# Altium schematic sheet BluetoothHC05.SchDoc
size A
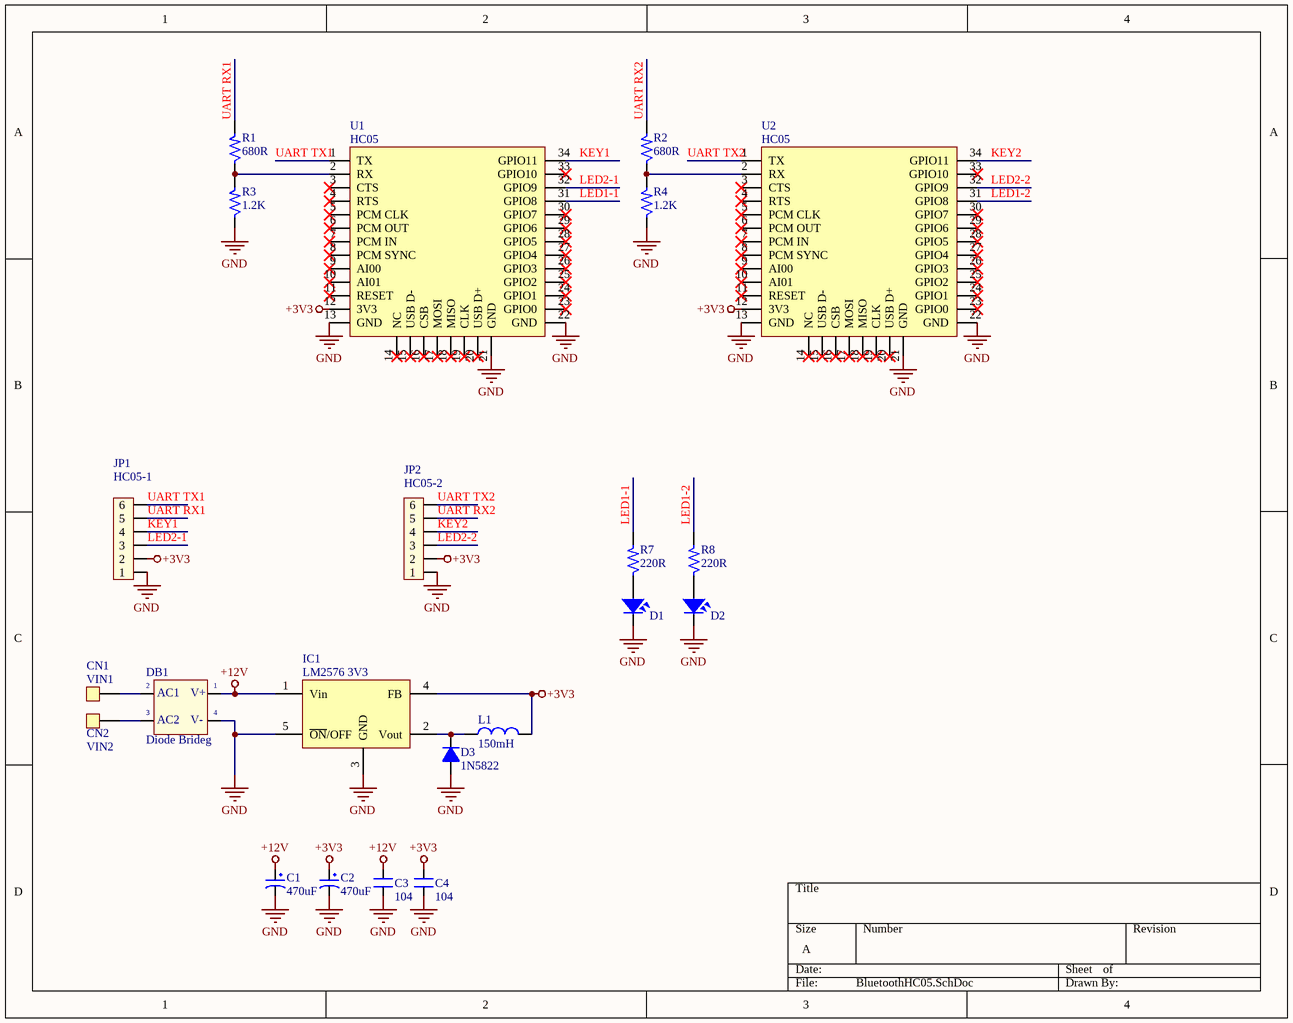
[diagram p0: BluetoothHC05.SchDoc]

## Parts
C1  470uF  [C-TANT-7343-31-CASEA]
C2  470uF  [C-TANT-7343-31-CASEA]
C3  104  [C-0805]
C4  104  [C-0805]
CN1  VIN1  [M3]
CN2  VIN2  [M3]
D1  LED  [LED-0805]  (value not drawn)
D2  LED  [LED-0805]  (value not drawn)
D3  1N5822  [D-DO214-AB]
DB1  Diode Brideg  [D-DB-1A-SMD]
IC1  LM2576 3V3  [TO-263-5L]
JP1  HC05-1  [JP6]
JP2  HC05-2  [JP6]
L1  150mH  [L-SMD-10x10]
R1  680R  [R-0805]
R2  680R  [R-0805]
R3  1.2K  [R-0805]
R4  1.2K  [R-0805]
R7  220R  [R-0805]
R8  220R  [R-0805]
U1  HC05  [LV-BC-2.0]
U2  HC05  [LV-BC-2.0]

## Nets
+3V3: C2.1 C4.2 IC1.4(FB) JP1.2 JP2.2 L1.2 U1.12(3V3) U2.12(3V3)
+12V: C1.1 C3.2 DB1.3(AC2) IC1.1(Vin)
GND: C1.2 C2.2 C3.1 C4.1 D1.2 D2.2 D3.1(A) DB1.4(-V_OUT) IC1.3(GND) IC1.5(~{ON}/OFF) IC1.HM(GND) JP1.1 JP2.1 R3.1 R4.1 U1.13(GND) U1.21(GND) U1.22(GND) U2.13(GND) U2.21(GND) U2.22(GND)
KEY1: JP1.4 U1.34(GPIO11)
KEY2: JP2.4 U2.34(GPIO11)
LED1-1: R7.2 U1.31(GPIO8)
LED1-2: R8.2 U2.31(GPIO8)
LED2-1: JP1.3 U1.32(GPIO9)
LED2-2: JP2.3 U2.32(GPIO9)
UART RX1: JP1.5 R1.2
UART RX2: JP2.5 R2.2
UART TX1: JP1.6 U1.1(TX)
UART TX2: JP2.6 U2.1(TX)
NetCN1_1: CN1.1 DB1.2(AC1)
NetCN2_1: CN2.1 DB1.1(+V_OUT)
NetD1_1: D1.1 R7.1
NetD2_1: D2.1 R8.1
NetD3_2: D3.2(K) IC1.2(Vout) L1.1
NetR1_1: R1.1 R3.2 U1.2(RX)
NetR2_1: R2.1 R4.2 U2.2(RX)

Not connected (* = marked no-connect by the designer): U1 3(CTS)* 4(RTS)* 5(PCM_CLK)* 6(PCM_OUT)* 7(PCM_IN)* 8(PCM_SYNC)* 9(AI00)* 10(AI01)* 11(RESET)* 14(NC)* 15(USB_D-)* 16(CSB)* 17(MOSI)* 18(MISO)* 19(CLK)* 20(USB_D+)* 23(GPIO0)* 24(GPIO1)* 25(GPIO2)* 26(GPIO3)* 27(GPIO4)* 28(GPIO5)* 29(GPIO6)* 30(GPIO7)* 33(GPIO10)*; U2 3(CTS)* 4(RTS)* 5(PCM_CLK)* 6(PCM_OUT)* 7(PCM_IN)* 8(PCM_SYNC)* 9(AI00)* 10(AI01)* 11(RESET)* 14(NC)* 15(USB_D-)* 16(CSB)* 17(MOSI)* 18(MISO)* 19(CLK)* 20(USB_D+)* 23(GPIO0)* 24(GPIO1)* 25(GPIO2)* 26(GPIO3)* 27(GPIO4)* 28(GPIO5)* 29(GPIO6)* 30(GPIO7)* 33(GPIO10)*

## Notes on the sheet
- (in symbol DB) V+; V-

## Library data of the parts
C1 C2 = CP1: Cap P  0,1uF < 22uF , 16 - 50V; Value: 10uF/50V; Description 1: 10 => 220uF/6,3V/10V - 10uF => 100uF/16V; Description 2: 0,1uF => 33uF/50V - 10uF => 22uF/63V; Description 3: 0,47uF => 10uF/100V
C3 C4 = CN: Value: 0,1uF/300V; Designed by: VanDungEvn
CN1 CN2 = COCDONGM3: Value: M3
D1 D2 = LED: LED Single colour Green and Red; Value: LED 3 ly Single Colour
D3 = D1A: Diode 1A; Value: 1N4007
DB1 = DB: Convert AC to DC voltage, 4 pin; Value: Cau 1A
IC1 = LM2576
JP1 JP2 = JP6: JP6 PIN; Value: JP7
L1 = L1: Inductor; Value: 150 mH
R1-R4 R7 R8 = R: Resistor 1/4W; Value: R1/4W - 1K
U1 U2 = HC05: Value: HC05